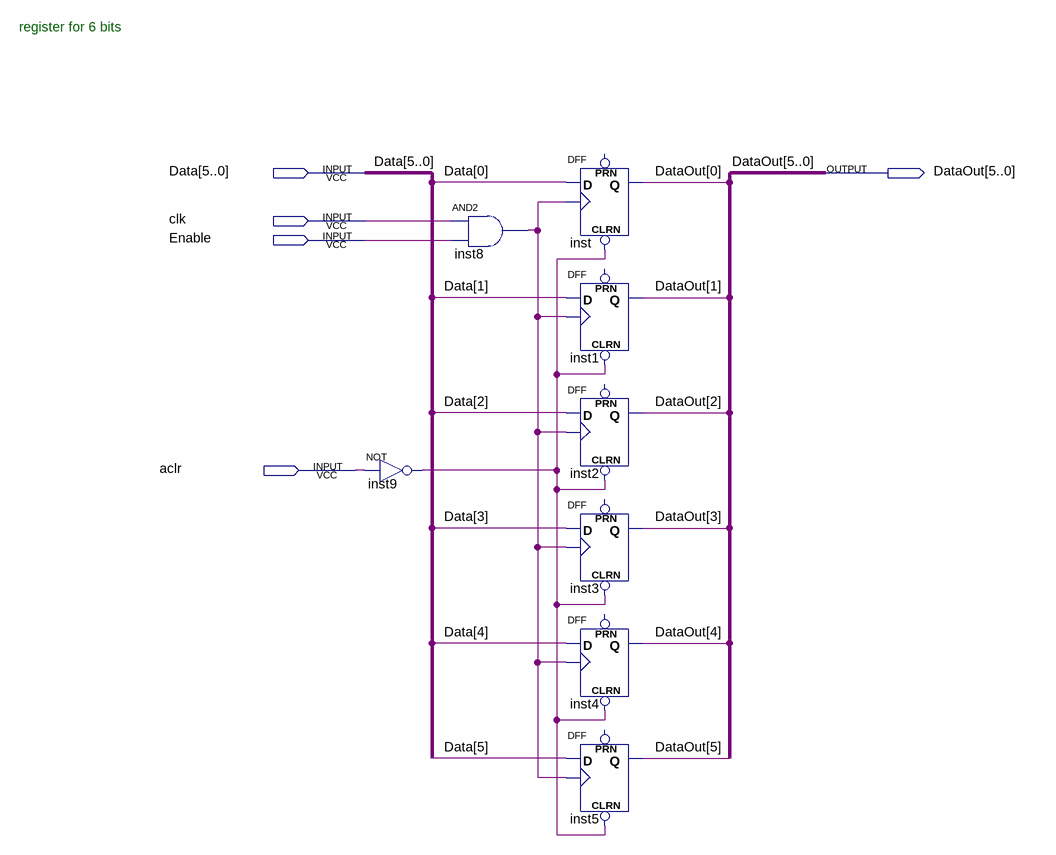
[diagram p0: schematic sheet]
// Quartus schematic reg6.bdf as structural Verilog: 8 symbols, 5 pins
module reg6 (
  input  [5:0] Data,
  input  clk,
  input  Enable,
  input  aclr,
  output [5:0] DataOut
);

  wire inst8_out, inst9_out;

  not inst9 (inst9_out, aclr);
  and inst8 (inst8_out, clk, Enable);
  DFF inst (.CLRN(inst9_out), .CLK(inst8_out), .D(Data[0]), .Q(DataOut[0]));  // open: PRN
  DFF inst1 (.CLRN(inst9_out), .CLK(inst8_out), .D(Data[1]), .Q(DataOut[1]));  // open: PRN
  DFF inst2 (.CLRN(inst9_out), .CLK(inst8_out), .D(Data[2]), .Q(DataOut[2]));  // open: PRN
  DFF inst3 (.CLRN(inst9_out), .CLK(inst8_out), .D(Data[3]), .Q(DataOut[3]));  // open: PRN
  DFF inst4 (.CLRN(inst9_out), .CLK(inst8_out), .D(Data[4]), .Q(DataOut[4]));  // open: PRN
  DFF inst5 (.CLRN(inst9_out), .CLK(inst8_out), .D(Data[5]), .Q(DataOut[5]));  // open: PRN

  // Notes on the sheet:
  //   register for 6 bits
endmodule
